# EAGLE design SuperJacobv5 (EAGLE 9.4.2)
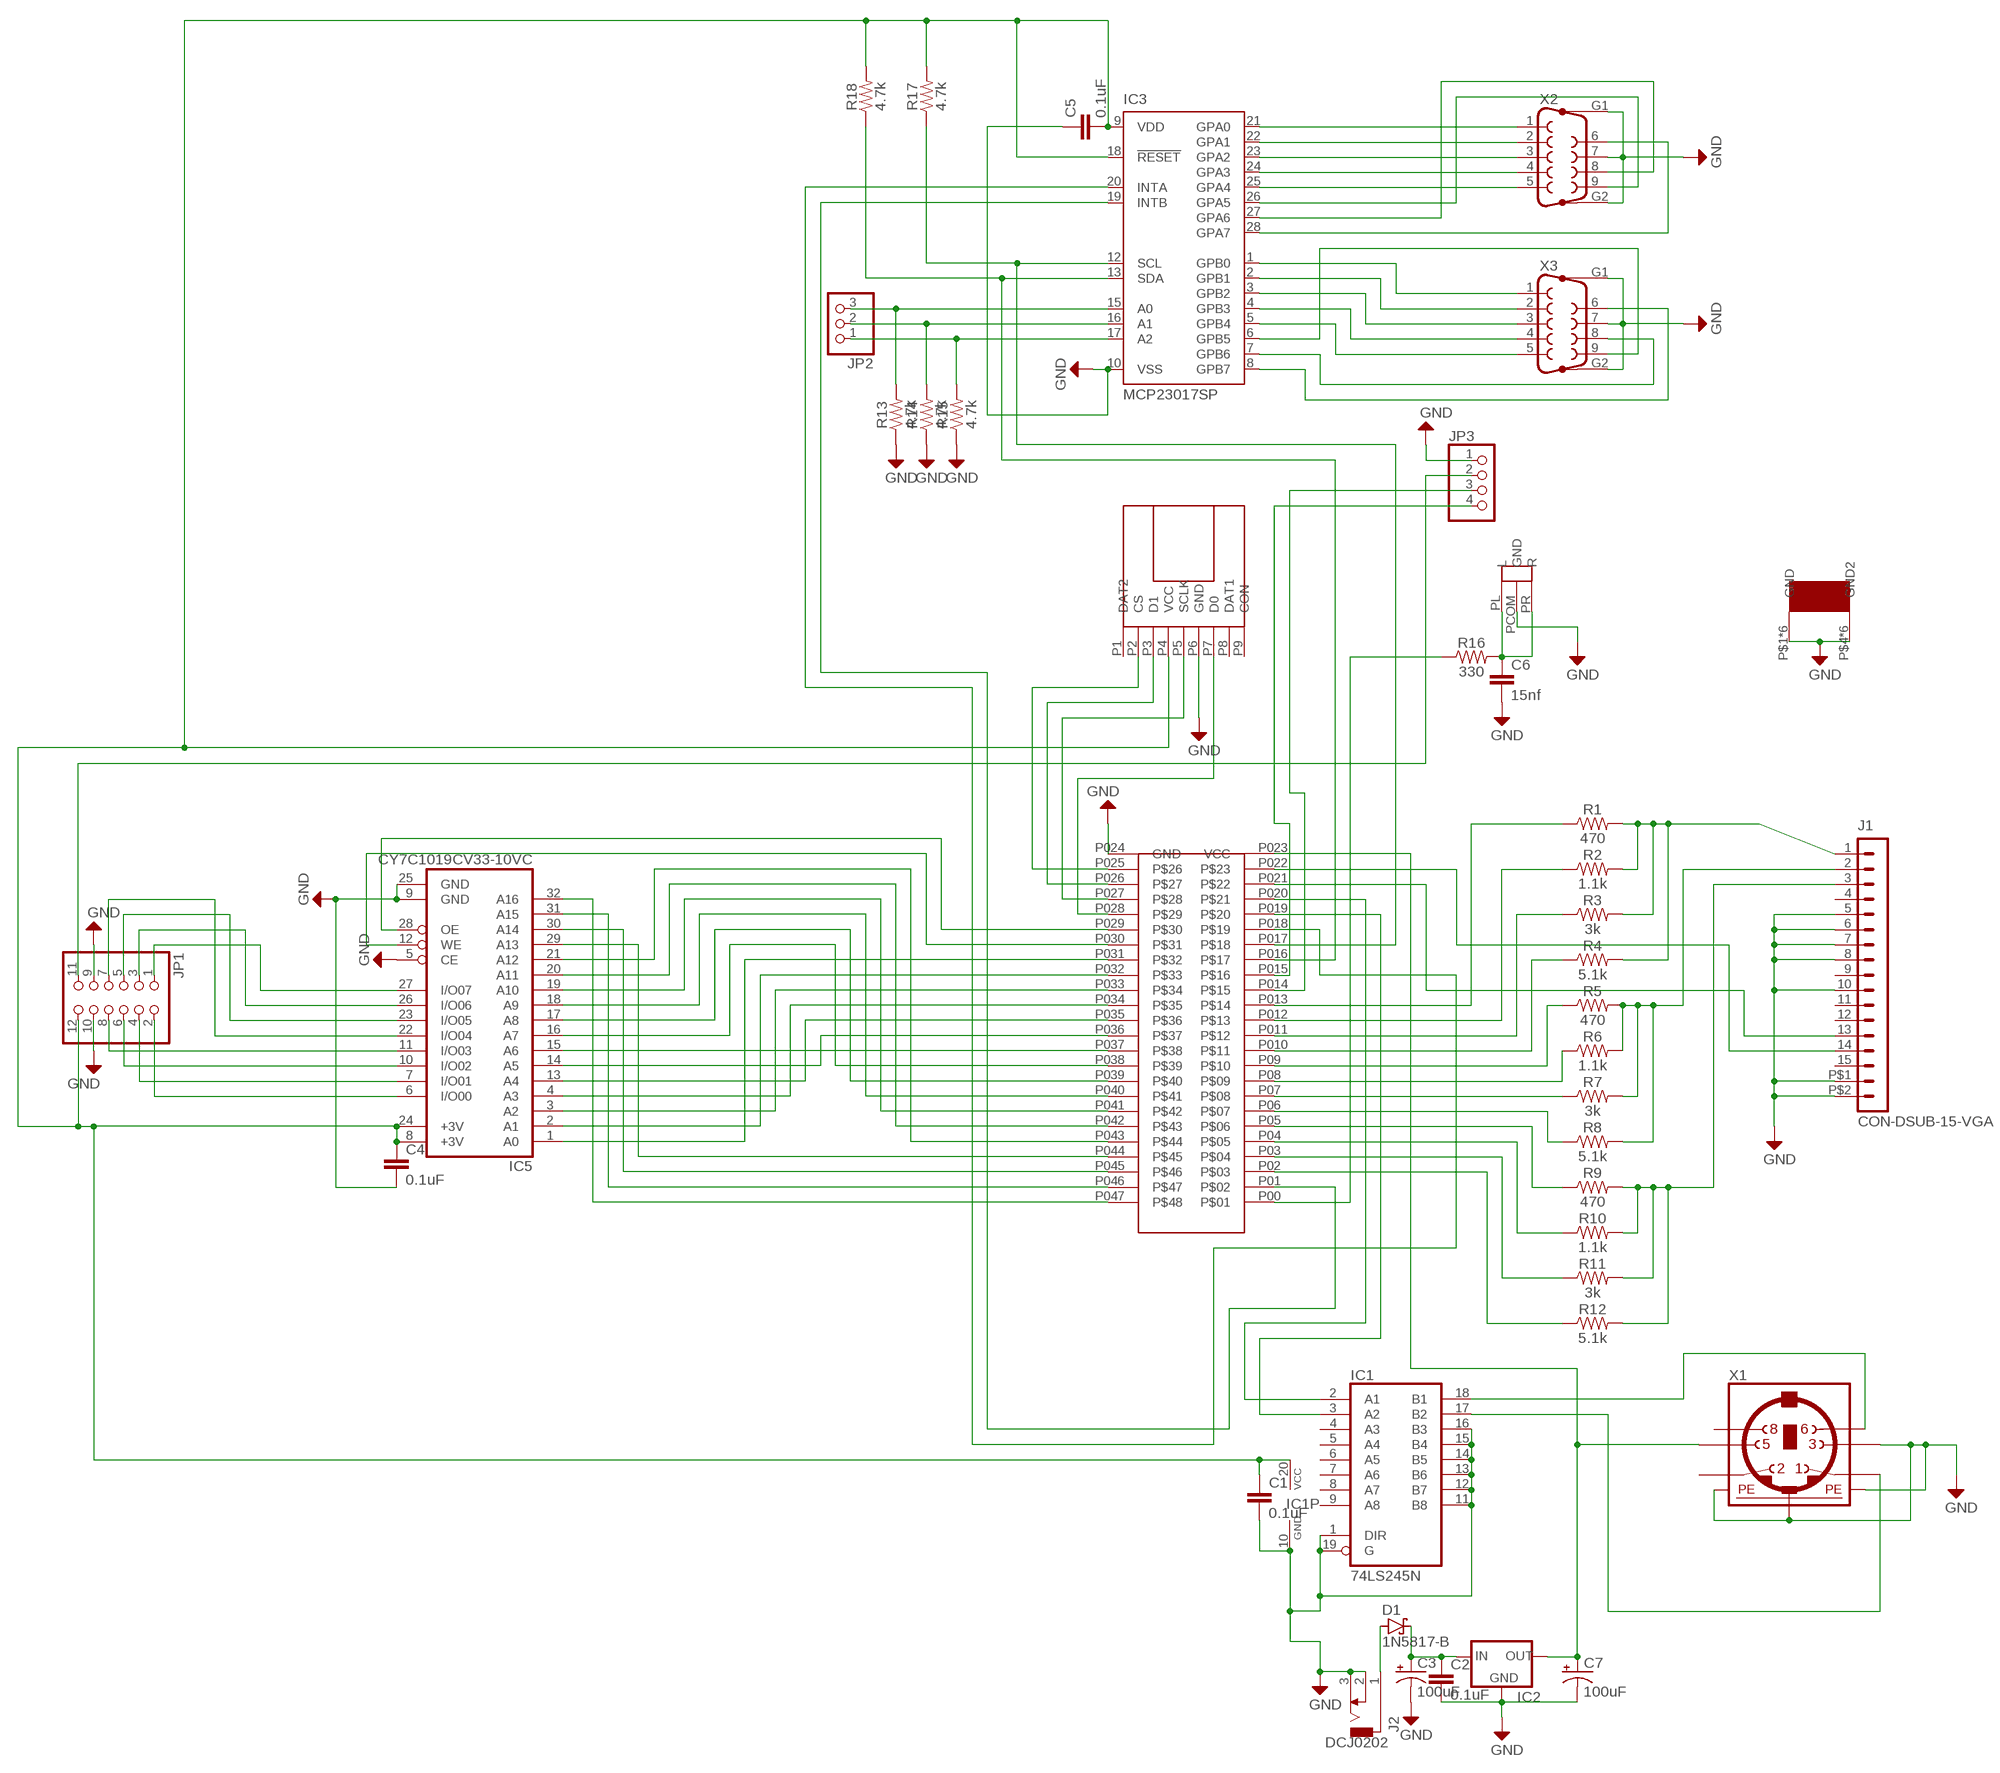
[diagram p0: schematic, sheet 1]

## Parts
C1  0.1uF  0.1UF-KIT-EZ-50V-20%  [CAP-PTH-SMALL-KIT]
C2  0.1uF  0.1UF-KIT-EZ-50V-20%  [CAP-PTH-SMALL-KIT]
C3  100uF  10UF-POLAR-RADIAL-2.5MM-25V-20%  [CPOL-RADIAL-2.5MM-5MM]
C4  0.1uF  0.1UF-KIT-EZ-50V-20%  [CAP-PTH-SMALL-KIT]
C5  0.1uF  0.1UF-KIT-EZ-50V-20%  [CAP-PTH-SMALL-KIT]
C6  15nf  0.1UF-KIT-EZ-50V-20%  [CAP-PTH-SMALL-KIT]
C7  100uF  10UF-POLAR-RADIAL-2.5MM-25V-20%  [CPOL-RADIAL-2.5MM-5MM]
D1  1N5817-B  [DO41-7.6]
IC1  74LS245N  [DIL20]
IC2  78XXL  [78XXL]
IC3  MCP23017SP  [DIL28-3]
IC5  CY7C1019CV33-10VC  [SOJ32-400]
J1  CON-DSUB-15-VGA  [181-015-212-171]
J2  DCJ0202  [DCJ0202]
JP1  PINHD-2X6  [2X06]
JP2  PINHD-1X3  [1X03]
JP3  PINHD-1X4  [1X04]
R1  470  1KOHM-HORIZ-1/4W-1%  [AXIAL-0.3]
R2  1.1k  1KOHM-HORIZ-1/4W-1%  [AXIAL-0.3]
R3  3k  1KOHM-HORIZ-1/4W-1%  [AXIAL-0.3]
R4  5.1k  1KOHM-HORIZ-1/4W-1%  [AXIAL-0.3]
R5  470  1KOHM-HORIZ-1/4W-1%  [AXIAL-0.3]
R6  1.1k  1KOHM-HORIZ-1/4W-1%  [AXIAL-0.3]
R7  3k  1KOHM-HORIZ-1/4W-1%  [AXIAL-0.3]
R8  5.1k  1KOHM-HORIZ-1/4W-1%  [AXIAL-0.3]
R9  470  1KOHM-HORIZ-1/4W-1%  [AXIAL-0.3]
R10  1.1k  1KOHM-HORIZ-1/4W-1%  [AXIAL-0.3]
R11  3k  1KOHM-HORIZ-1/4W-1%  [AXIAL-0.3]
R12  5.1k  1KOHM-HORIZ-1/4W-1%  [AXIAL-0.3]
R13  4.7k  1KOHM-HORIZ-1/4W-1%  [AXIAL-0.3]
R14  4.7k  1KOHM-HORIZ-1/4W-1%  [AXIAL-0.3]
R15  4.7k  1KOHM-HORIZ-1/4W-1%  [AXIAL-0.3]
R16  330  1KOHM-HORIZ-1/4W-1%  [AXIAL-0.3]
R17  4.7k  1KOHM-HORIZ-1/4W-1%  [AXIAL-0.3]
R18  4.7k  1KOHM-HORIZ-1/4W-1%  [AXIAL-0.3]
U$1  CMODA7  [CMODA7]
U$2  OPEN-SMARTTFCARDBREAKOUT  [OPEN-SMARTTFCARDBREAKOUT]
U$3  AUDIOJACK  [AUDIOJACK]
U$4  7085THERMALPAD  [7805THERMALPAD]
X1  MINI_DIN_6  [M_DIN6]
X2  F09HP  [F09HP]
X3  F09HP  [F09HP]

## Nets
+5V: C7.1(+) IC2.OUT U$1.P023(VCC) X1.5
ANLGPAD1: JP3.3 U$1.P014
ANLGPAD2: JP3.4 U$1.P015
AUDIOPOSTFILTER: C6.1 R16.P$2 U$3.PL(L) U$3.PR(R)
AUDIOPREFILTER: R16.P$1 U$1.P00
BLUE: J1.3 R9.P$2 R10.P$2 R11.P$2 R12.P$2
BLUEBIT0: R12.P$1 U$1.P02
BLUEBIT1: R11.P$1 U$1.P03
BLUEBIT2: R10.P$1 U$1.P04
BLUEBIT3: R9.P$1 U$1.P05
GND: C1.2 C2.2 C3.2(-) C4.2 C5.1 C6.2 C7.2(-) IC1.1(DIR) IC1.10(GND) IC1.11(B8) IC1.12(B7) IC1.13(B6) IC1.14(B5) IC1.15(B4) IC1.16(B3) IC1.19(G) IC2.GND IC3.10(VSS) IC5.5(CE) IC5.9(GND) IC5.25(GND) J1.5 J1.6 J1.7 J1.8 J1.10 J1.P$1 J1.P$2 J2.2 J2.3 JP1.9 JP1.10 JP3.1 R13.P$1 R14.P$1 R15.P$1 U$1.P024(GND) U$2.P6(GND) U$3.PCOM(GND) U$4.P$1(GND) U$4.P$4(GND2) U$4.P$6(GND) U$4.P$7(GND) U$4.P$8(GND) U$4.P$9(GND) U$4.P$10(GND) U$4.P$11(GND2) U$4.P$14(GND2) U$4.P$19(GND2) U$4.P$21(GND2) U$4.P$24(GND2) X1.3 X1.SH1(PE1) X1.SH2(PE2) X1.SH3(PE3) X2.7 X2.G1 X2.G2 X3.7 X3.G1 X3.G2
GPIOCLK: IC3.12(SCL) R17.P$1 U$1.P017
GPIODATA: IC3.13(SDA) R18.P$1 U$1.P016
GPIOINTA: IC3.20(INTA) U$1.P018
GPIOINTB: IC3.19(INTB) U$1.P01
GREEN: J1.2 R5.P$2 R6.P$2 R7.P$2 R8.P$2
GREENBIT0: R8.P$1 U$1.P06
GREENBIT1: R7.P$1 U$1.P07
GREENBIT2: R6.P$1 U$1.P08
GREENBIT3: R5.P$1 U$1.P09
HSYNC: J1.13 U$1.P021
IOADDR0: IC3.15(A0) JP2.3 R13.P$2
IOADDR1: IC3.16(A1) JP2.2 R14.P$2
IOADDR2: IC3.17(A2) JP2.1 R15.P$2
JOY1DOWN: IC3.24(GPA3) X2.4
JOY1FIRE: IC3.26(GPA5) X2.9
JOY1LEFT: IC3.23(GPA2) X2.3
JOY1RIGHT: IC3.22(GPA1) X2.2
JOY1SPARE1: IC3.21(GPA0) X2.1
JOY1SPARE2: IC3.27(GPA6) X2.8
JOY1SPARE3: IC3.28(GPA7) X2.6
JOY1UP: IC3.25(GPA4) X2.5
JOY2DOWN: IC3.4(GPB3) X3.4
JOY2FIRE: IC3.6(GPB5) X3.9
JOY2LEFT: IC3.3(GPB2) X3.3
JOY2RIGHT: IC3.2(GPB1) X3.2
JOY2SPARE1: IC3.1(GPB0) X3.1
JOY2SPARE2: IC3.7(GPB6) X3.8
JOY2SPARE3: IC3.8(GPB7) X3.6
JOY2UP: IC3.5(GPB4) X3.5
KBCLK: IC1.18(B1) X1.6
KBCLK33V: IC1.2(A1) U$1.P020
KBDATA: IC1.17(B2) X1.1
KBDATA33V: IC1.3(A2) U$1.P019
N$1: D1.A J2.1
POWERIN: C2.1 C3.1(+) D1.C IC2.IN
RAM10: IC5.19(A10) U$1.P041
RAM11: IC5.20(A11) U$1.P042
RAMA0: IC5.1(A0) U$1.P031
RAMA1: IC5.2(A1) U$1.P032
RAMA2: IC5.3(A2) U$1.P033
RAMA3: IC5.4(A3) U$1.P034
RAMA4: IC5.13(A4) U$1.P035
RAMA5: IC5.14(A5) U$1.P036
RAMA6: IC5.15(A6) U$1.P037
RAMA7: IC5.16(A7) U$1.P038
RAMA8: IC5.17(A8) U$1.P039
RAMA9: IC5.18(A9) U$1.P040
RAMA12: IC5.21(A12) U$1.P043
RAMA13: IC5.29(A13) U$1.P044
RAMA14: IC5.30(A14) U$1.P045
RAMA15: IC5.31(A15) U$1.P046
RAMA16: IC5.32(A16) U$1.P047
RAMIO0: IC5.6(I/O00) JP1.2
RAMIO1: IC5.7(I/O01) JP1.4
RAMIO2: IC5.10(I/O02) JP1.6
RAMIO3: IC5.11(I/O03) JP1.8
RAMIO4: IC5.22(I/O04) JP1.7
RAMIO5: IC5.23(I/O05) JP1.5
RAMIO6: IC5.26(I/O06) JP1.3
RAMIO7: IC5.27(I/O07) JP1.1
RAMOE: IC5.28(OE) U$1.P029
RAMWE: IC5.12(WE) U$1.P030
RED: J1.1 R1.P$2 R2.P$2 R3.P$2 R4.P$2
REDBIT0: R4.P$1 U$1.P010
REDBIT1: R3.P$1 U$1.P011
REDBIT2: R2.P$1 U$1.P012
REDBIT3: R1.P$1 U$1.P013
SDCLK: U$1.P027 U$2.P5(SCLK)
SDCS: U$1.P025 U$2.P2(CS)
SDD0: U$1.P028 U$2.P7(D0)
SDD1: U$1.P026 U$2.P3(D1)
VCC3.3V-EXT: JP1.11 JP3.2
VCC+3.3V: C1.1 C4.1 C5.2 IC1.20(VCC) IC3.9(VDD) IC3.18(!RESET) IC5.8(+3V) IC5.24(+3V) JP1.12 R17.P$2 R18.P$2 U$2.P4(VCC)
VSYNC: J1.14 U$1.P022
Unconnected: IC1.4(A3) IC1.5(A4) IC1.6(A5) IC1.7(A6) IC1.8(A7) IC1.9(A8) J1.4 J1.9 J1.11 J1.12 J1.15 U$2.P1(DAT2) U$2.P8(DAT1) U$2.P9(CON) X1.2 X1.8

## Library data of the parts
C1 C2 C4 C5 = SparkFun-Capacitors:0.1UF: 0.1µF ceramic capacitors A capacitor is a passive two-terminal electrical component used to store electrical energy temporarily in an electric field.; PROD_ID: CAP-08370
C3 C7 = SparkFun-Capacitors:10UF-POLAR: 10.0µF polarized capacitors A capacitor is a passive two-terminal electrical component used to store electrical energy temporarily in an electric field.; PROD_ID: CAP-08440; VALUE: 10uF
C6 = SparkFun-Capacitors:0.1UF: 0.1µF ceramic capacitors A capacitor is a passive two-terminal electrical component used to store electrical energy temporarily in an electric field.; PROD_ID: CAP-08370; VALUE: 0.1uF
D1 = diode:1N581*: 1.0A SCHOTTKY BARRIER RECTIFIER Source: http://www.diodes.com/datasheets/ds23001.pdf
IC1 = 74xx-eu:74*245: Octal BUS TRANSCEIVER, 3-state
IC2 = v-reg:78XXL: VOLTAGE REGULATOR
IC3 = microchip:MCP23017: http://ww1.microchip.com/downloads/en/DeviceDoc/21952a.pdf Source: http://ww1.microchip.com/downloads/en/DeviceDoc/21952a.pdf; MF: MICROCHIP; MPN: MCP23017-E/SP; OC_FARNELL: 1332088; OC_NEWARK: 31K2959
IC5 = CY7C109D:CY7C1019CV33: 128K x 8 Static RAM 10ns Source: Cypress CYP05780611.pdf
J1 = m-pad-2.1:CON-DSUB-15-VGA: NORCOMP's High Density 90° PC Mount D-Sub Connector 181 Series: SPECIFICATIONS: Contact Rating: 5 Amps Dielectric Strength: 1000V AC RMS Insulation Resistance: 1000 meg ohms Contact Material: Phosphor Bronze Contact Finish: Gold flash over Nickel Operating Temperature: -55°C to 150°C Shell Material: Steel, Tin Plated Insulations Material: Glass-Filled Polyester (UL94V-0) Gender: Receptacle (female) Please send any comments to: messi@users.sourceforge.net
J2 = con-jack:DCJ0202: DC POWER JACK Source: DCJ0202.pdf; OC_FARNELL: unknown; OC_NEWARK: unknown
JP1 = pinhead:PINHD-2X6: PIN HEADER
JP2 = pinhead:PINHD-1X3: PIN HEADER
JP3 = pinhead:PINHD-1X4: PIN HEADER
R1-R18 = SparkFun-Resistors:1KOHM: 1kΩ resistor A resistor is a passive two-terminal electrical component that implements electrical resistance as a circuit element. Resistors act to reduce current flow, and, at the same time, act to lower voltage levels within circuits. - Wikipedia; PROD_ID: RES-12182; VALUE: 1k
U$1 = my-library:CMODA7
U$2 = my-library:OPEN-SMARTTFCARDBREAKOUT
U$3 = my-library:AUDIOJACK
U$4 = my-library:7085THERMALPAD
X1 = mini_din:MINI_DIN_6
X2 X3 = con-subd:F09HP: SUB-D; OC_FARNELL: unknown; OC_NEWARK: unknown

## Board
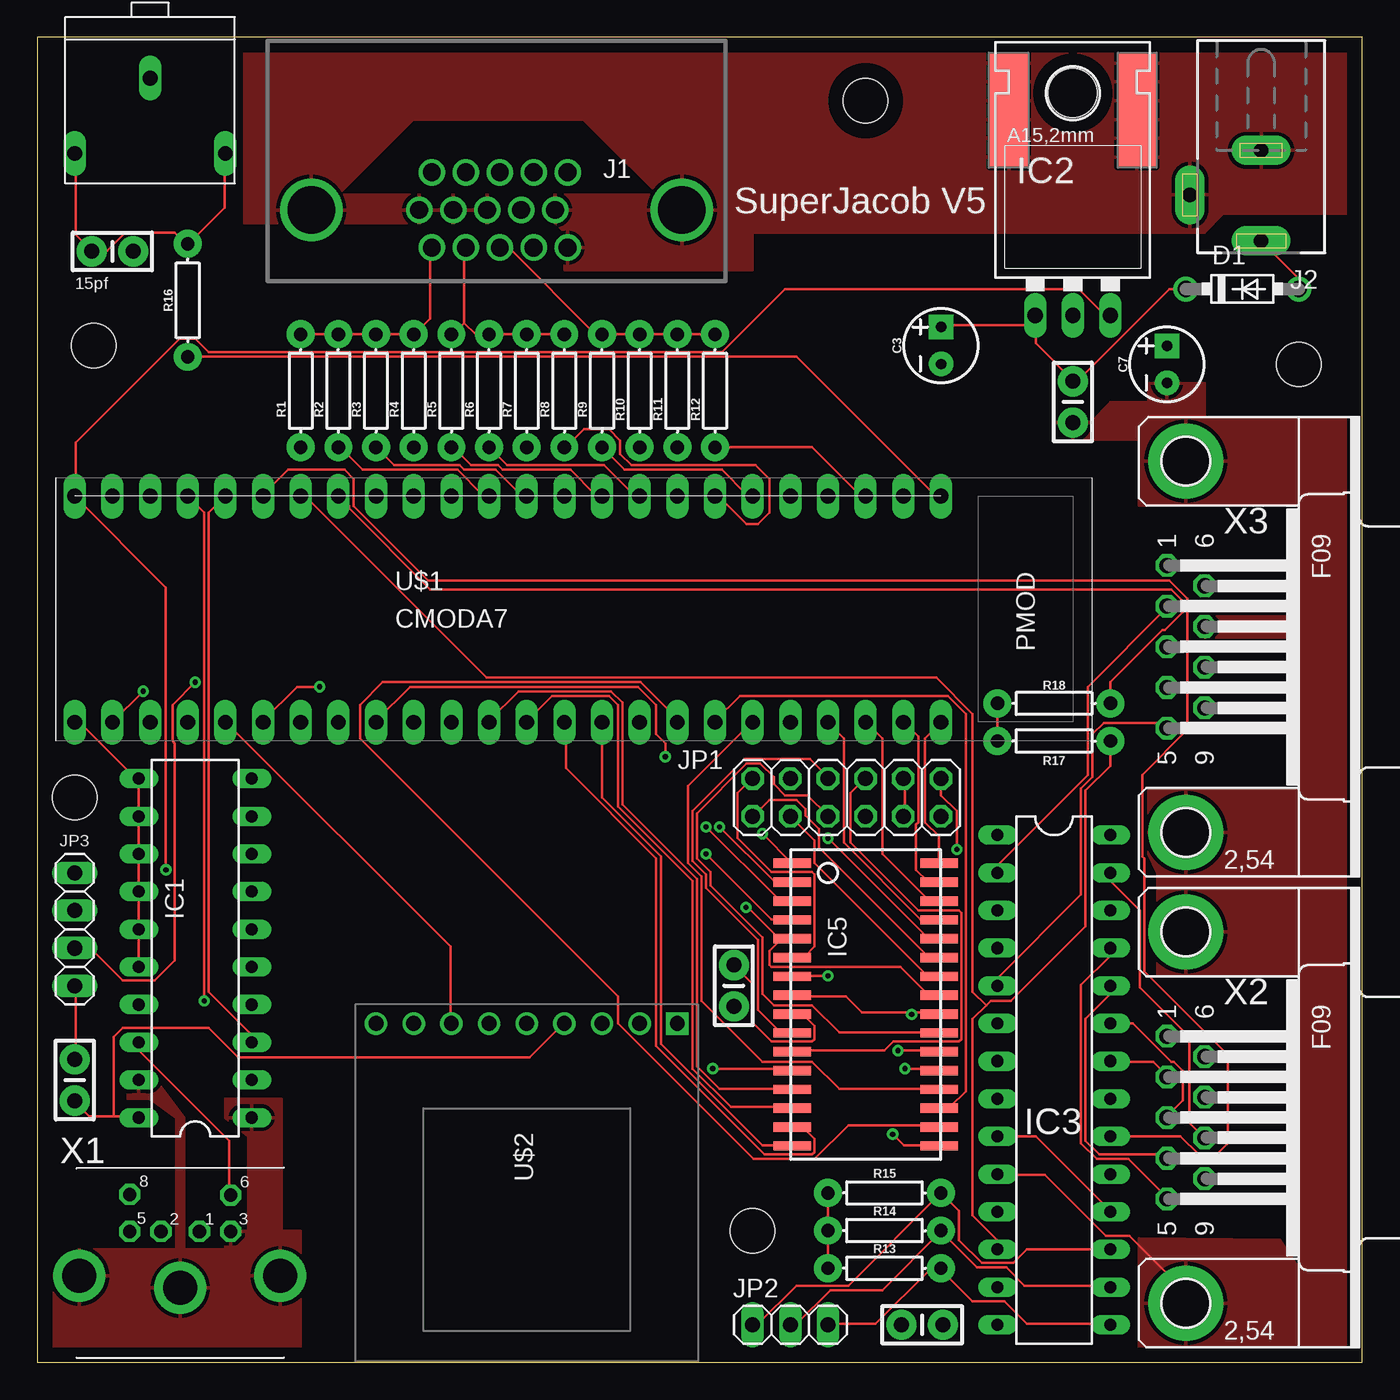
[diagram p1: board, top side]
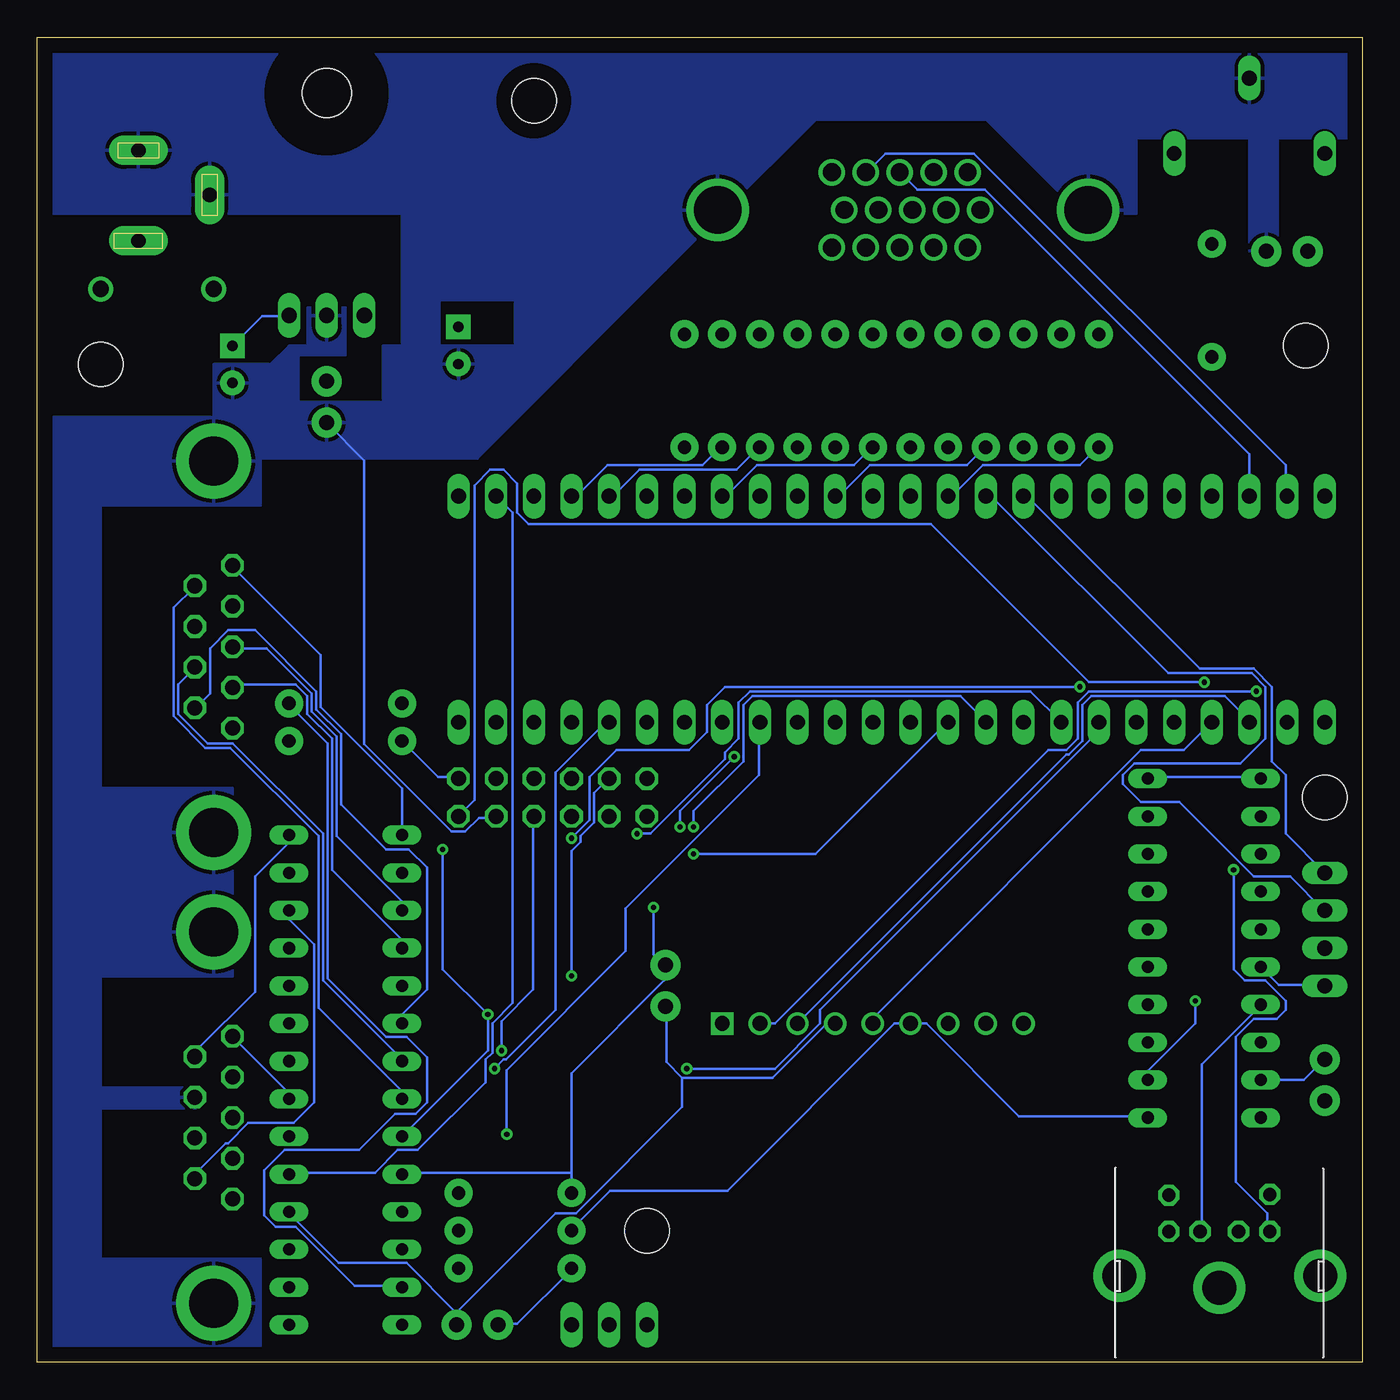
[diagram p2: board, bottom side, seen from below]

Size 89.38 x 89.38 mm. Coordinates in mm from the lower left corner, seen from the top.
Outline: 0,0 89.38,0 89.38,89.38 0,89.38 0,0
Copper layers (1*16): Top 0.035mm / dielectric 1.5mm / Bottom 0.035mm
Design rules "default": minimum track width 6mil, minimum drill 0.35mm, track to track 6mil, track to pad 6mil, pad to pad 6mil, via to via 6mil, smd to smd 6mil, copper to edge 40mil, drill to drill 6mil, minimum pad ring 10mil, minimum via ring 8mil, stop-mask expansion 4mil, vias tented up to drill 0mil, thermal gap 10mil
Holes 3 mm at 85.09,67.31 48.26,8.89 3.81,68.58 2.54,38.1 55.88,85.09

### Footprints (pad centres in the part's own frame; a part is rotated, then mirrored left to right if it is on the bottom)
CAP-PTH-SMALL-KIT = drill 1.016 pad 2.032: 1 -1.397,0; 2 1.397,0
CPOL-RADIAL-2.5MM-5MM = drill 0.7 pad 1.651 square: 1 1.25,0 | drill 0.7 pad 1.651: 2 -1.25,0
DO41-7.6 = drill 1.1 pad 1.7: A 3.81,0; C -3.81,0
DIL20 = drill 0.813 long: 1 -11.43,-3.81; 2 -8.89,-3.81; 3 -6.35,-3.81; 4 -3.81,-3.81; 5 -1.27,-3.81; 6 1.27,-3.81; 7 3.81,-3.81; 8 6.35,-3.81; 9 8.89,-3.81; 10 11.43,-3.81; 11 11.43,3.81; 12 8.89,3.81; 13 6.35,3.81; 14 3.81,3.81; 15 1.27,3.81; 16 -1.27,3.81; 17 -3.81,3.81; 18 -6.35,3.81; 19 -8.89,3.81; 20 -11.43,3.81
78XXL = drill 1.016 long: GND 0,-3.81; IN -2.54,-3.81; OUT 2.54,-3.81 | hole 3.302: 0,11.176
DIL28-3 = drill 0.813 long: 1 -16.51,-3.81; 2 -13.97,-3.81; 3 -11.43,-3.81; 4 -8.89,-3.81; 5 -6.35,-3.81; 6 -3.81,-3.81; 7 -1.27,-3.81; 8 1.27,-3.81; 9 3.81,-3.81; 10 6.35,-3.81; 11 8.89,-3.81; 12 11.43,-3.81; 13 13.97,-3.81; 14 16.51,-3.81; 15 16.51,3.81; 16 13.97,3.81; 17 11.43,3.81; 18 8.89,3.81; 19 6.35,3.81; 20 3.81,3.81; 21 1.27,3.81; 22 -1.27,3.81; 23 -3.81,3.81; 24 -6.35,3.81; 25 -8.89,3.81; 26 -11.43,3.81; 27 -13.97,3.81; 28 -16.51,3.81
SOJ32-400 = smd 0.635 x 2.54: 1 -9.525,-4.953; 2 -8.255,-4.953; 3 -6.985,-4.953; 4 -5.715,-4.953; 5 -4.445,-4.953; 6 -3.175,-4.953; 7 -1.905,-4.953; 8 -0.635,-4.953; 9 0.635,-4.953; 10 1.905,-4.953; 11 3.175,-4.953; 12 4.445,-4.953; 13 5.715,-4.953; 14 6.985,-4.953; 15 8.255,-4.953; 16 9.525,-4.953; 17 9.525,4.953; 18 8.255,4.953; 19 6.985,4.953; 20 5.715,4.953; 21 4.445,4.953; 22 3.175,4.953; 23 1.905,4.953; 24 0.635,4.953; 25 -0.635,4.953; 26 -1.905,4.953; 27 -3.175,4.953; 28 -4.445,4.953; 29 -5.715,4.953; 30 -6.985,4.953; 31 -8.255,4.953; 32 -9.525,4.953
181-015-212-171 = drill 1.194: 1 4.371,2.541; 2 2.08,2.541; 3 -0.211,2.541; 4 -2.502,2.541; 5 -4.793,2.541; 6 5.217,0; 7 2.926,0; 8 0.635,0; 9 -1.656,0; 10 -3.947,0; 11 4.371,-2.541; 12 2.08,-2.541; 13 -0.211,-2.541; 14 -2.502,-2.541; 15 -4.793,-2.541 | drill 3.2: P$1 -12.502,0; P$2 12.502,0
DCJ0202 = drill 1 pad 2 long: 1 0,3.1; 2 4.8,0; 3 0,-3
2X06 = drill 1.016 octagon: 1 -6.35,-1.27; 2 -6.35,1.27; 3 -3.81,-1.27; 4 -3.81,1.27; 5 -1.27,-1.27; 6 -1.27,1.27; 7 1.27,-1.27; 8 1.27,1.27; 9 3.81,-1.27; 10 3.81,1.27; 11 6.35,-1.27; 12 6.35,1.27
1X03 = drill 1.016 long: 1 -2.54,0; 2 0,0; 3 2.54,0
1X04 = drill 1.016 long: 1 -3.81,0; 2 -1.27,0; 3 1.27,0; 4 3.81,0
AXIAL-0.3 = drill 0.9 pad 1.88: P$1 -3.81,0; P$2 3.81,0
CMODA7 = drill 1 long: P00 -7.62,25.4; P01 -7.62,22.86; P02 -7.62,20.32; P03 -7.62,17.78; P04 -7.62,15.24; P05 -7.62,12.7; P06 -7.62,10.16; P07 -7.62,7.62; P08 -7.62,5.08; P09 -7.62,2.54; P010 -7.62,0; P011 -7.62,-2.54; P012 -7.62,-5.08; P013 -7.62,-7.62; P014 -7.62,-10.16; P015 -7.62,-12.7; P016 -7.62,-15.24; P017 -7.62,-17.78; P018 -7.62,-20.32; P019 -7.62,-22.86; P020 -7.62,-25.4; P021 -7.62,-27.94; P022 -7.62,-30.48; P023 -7.62,-33.02; P024 7.62,-33.02; P025 7.62,-30.48; P026 7.62,-27.94; P027 7.62,-25.4; P028 7.62,-22.86; P029 7.62,-20.32; P030 7.62,-17.78; P031 7.62,-15.24; P032 7.62,-12.7; P033 7.62,-10.16; P034 7.62,-7.62; P035 7.62,-5.08; P036 7.62,-2.54; P037 7.62,0; P038 7.62,2.54; P039 7.62,5.08; P040 7.62,7.62; P041 7.62,10.16; P042 7.62,12.7; P043 7.62,15.24; P044 7.62,17.78; P045 7.62,20.32; P046 7.62,22.86; P047 7.62,25.4
OPEN-SMARTTFCARDBREAKOUT = drill 1 square: P1 5.08,10.16 | drill 1: P2 5.08,7.62; P3 5.08,5.08; P4 5.08,2.54; P5 5.08,0; P6 5.08,-2.54; P7 5.08,-5.08; P8 5.08,-7.62; P9 5.08,-10.16
AUDIOJACK = drill 1 long: PCOM 0,-3.81; PL -5.08,1.27; PR 5.08,1.27
7805THERMALPAD = smd 2.54 x 1.27: P$1 -5.588,1.27; P$4 3.048,1.27; P$6 -5.588,0; P$7 -5.588,-1.27; P$8 -5.588,-2.54; P$9 -5.588,-3.81; P$10 -5.588,-5.08; P$11 3.048,-2.54; P$14 3.048,-1.27; P$19 3.048,0; P$21 3.048,-3.81; P$24 3.048,-5.08
M_DIN6 = drill 0.9 pad 1.422 octagon: 1 -1.3,-3.75; 2 1.3,-3.75; 3 -3.4,-3.75; 5 3.4,-3.75; 6 -3.4,-6.2; 8 3.4,-6.25 | drill 2.3 pad 3.5: SH1 6.8,-0.75; SH2 0,0.05; SH3 -6.75,-0.75
F09HP = drill 1.016 octagon: 1 -5.486,-1.27; 2 -2.743,-1.27; 3 0,-1.27; 4 2.743,-1.27; 5 5.486,-1.27; 6 -4.115,1.27; 7 -1.372,1.27; 8 1.372,1.27; 9 4.115,1.27 | drill 3.302 pad 5.08: G1 -12.522,0; G2 12.522,0

### Placement (x,y rotation side)
C1  2.54,19.05 90 top
C2  69.85,64.77 270 top
C3  60.96,68.58 90 top
C4  46.99,25.4 90 top
C5  59.69,2.54 0 top
C6  5.08,74.93 0 top
C7  76.2,67.31 90 top
D1  81.28,72.39 0 top
IC1  10.67,27.94 90 top
IC2  69.85,74.42 0 top
IC3  68.58,19.05 270 top
IC5  55.88,24.13 270 top
J1  30.99,77.72 180 top
J2  82.55,78.74 180 top
JP1  54.61,38.1 0 top
JP2  50.8,2.54 0 top
JP3  2.54,29.21 90 top
R1  17.78,65.53 90 top
R2  20.32,65.53 90 top
R3  22.86,65.53 90 top
R4  25.4,65.53 90 top
R5  27.94,65.53 90 top
R6  30.48,65.53 90 top
R7  33.02,65.53 90 top
R8  35.56,65.53 90 top
R9  38.1,65.53 90 top
R10  40.64,65.53 90 top
R11  43.18,65.53 90 top
R12  45.72,65.53 90 top
R13  57.15,6.35 0 top
R14  57.15,8.89 0 top
R15  57.15,11.43 0 top
R16  10.16,71.63 90 top
R17  68.58,41.91 180 top
R18  68.58,44.45 180 top
U$1  35.56,50.8 270 top
U$2  33.02,27.94 270 top
U$3  7.62,82.8 180 top
U$4  71.12,86.36 0 top
X1  9.65,5.08 180 top
X2  77.47,16.51 270 top
X3  77.47,48.26 270 top

### Tracks (layer width: path | path; a pad name or v marks a point on that pad's centre or on a via)
+5V  (via drill 0.35)
  Top 0.152: v8.69,33.22 8.69,52.27 U$1.P023 2.59,58.52 2.59,62.03 9.6,69.04 10.67,69.04 11.58,68.12 46.18,68.12 50.44,72.39 70.26,72.39 71.93,70.71 72.39,70.71 IC2.OUT
  Bottom 0.152: IC2.OUT 72.39,70.56 74.22,70.56 76.2,68.58 C7.1 | v8.69,33.22 8.69,26.52 7.92,25.76 6.55,25.76 5.18,24.38 5.18,23.77 5.79,23.16 7.32,23.16 8.53,21.95 8.53,12.19 6.4,10.06 6.4,8.84 X1.5
ANLGPAD1
  Bottom 0.152: U$1.P014 25.3,58.37 24.99,58.37 13.11,46.48 7.47,46.48 6.55,45.57 6.55,42.06 8.23,40.39 15.39,40.39 16.15,39.62 16.15,39.01 14.94,37.8 12.34,37.8 7.32,32.77 4.88,32.77 2.59,30.48 JP3.3
ANLGPAD2
  Bottom 0.152: JP3.4 5.18,35.66 5.18,39.62 6.1,40.54 6.1,45.57 7.32,46.79 10.97,46.79 22.55,58.37 22.86,58.37 U$1.P015
AUDIOPOSTFILTER
  Top 0.152: U$3.PR 2.59,81.53 2.59,76.05 3.66,74.98 C6.1 3.81,74.98 4.72,74.98 5.94,76.2 9.3,76.2 10.06,75.44 R16.P$2 10.21,75.44 12.65,77.88 12.65,81.53 U$3.PL
AUDIOPREFILTER
  Top 0.152: R16.P$1 51.21,67.82 60.5,58.52 60.96,58.52 U$1.P00
BLUE
  Top 0.152: R12.P$2 R11.P$2 R10.P$2 R9.P$2 37.64,69.34 31.85,75.13 31.24,75.13 J1.3
BLUEBIT0
  Top 0.152: R12.P$1 52.27,61.72 55.47,58.52 55.78,58.52 U$1.P02
BLUEBIT1
  Bottom 0.152: U$1.P03 53.34,58.52 52.88,58.52 50.9,60.5 44.5,60.5 43.28,61.72 R11.P$1
BLUEBIT2
  Bottom 0.152: U$1.P04 50.75,58.52 50.44,58.52 48.77,60.2 42.22,60.2 40.69,61.72 R10.P$1
BLUEBIT3
  Top 0.152: R9.P$1 39.62,60.2 46.18,60.2 47.85,58.52 48.16,58.52 U$1.P05
GND  (via drill 0.35)
  Top 0.152: JP3.1 2.59,25.3 2.59,20.57 C1.2 | IC1.16 IC1.15 IC1.14 IC1.13 IC1.12 6.86,39.17 | IC1.11 6.86,39.17 | 6.86,39.17 2.9,43.13 2.59,43.13 U$1.P024 | 50.14,28.5 50.9,28.5 IC5.5 50.14,28.5 | 50.14,28.5 49.38,27.74 49.38,26.82 49.53,26.67 58.22,26.67 60.05,24.84 60.81,24.84 IC5.25 | IC5.9 51.05,23.47 51.66,23.47 52.43,22.71 52.43,21.79 52.27,21.64 49.53,21.64 48.31,22.86 48.31,25.45 47.09,26.67 C4.2 | R13.P$1 R14.P$1 R15.P$1 | 50.14,28.5 47.95,30.68 v47.8,30.68 | JP1.9 58.52,36.88 58.52,39.32 JP1.10 | IC3.10 64.77,12.65 67.97,12.65 72.08,8.53 73.66,8.53 77.47,4.72 X2.G2
  Bottom 0.152: IC1.1 14.48,16.61 23.16,16.61 29.41,22.86 U$2.P6 31.55,22.86 42.82,11.58 50.75,11.58 53.34,8.99 R14.P$1 | IC1.19 3.96,19.05 2.59,20.42 C1.2 | IC1.10 14.48,39.47 6.86,39.47 IC1.11 | IC1.16 5.64,25.45 2.59,25.45 JP3.1 | C5.1 58.22,2.59 57,2.59 53.34,6.25 R13.P$1 | R15.P$1 53.34,12.8 | 53.34,12.8 53.34,19.51 47.09,25.76 47.09,26.67 C4.2 47.09,26.82 47.8,27.53 v47.8,30.68 | JP1.9 58.52,36.73 59.59,36.73 60.5,35.81 61.42,35.81 67.31,41.71 67.31,60.83 C2.2 | 53.34,12.8 64.77,12.8 IC3.10
  pour Top: 77.47,88.9 77.47,76.2 48.26,76.2 48.26,88.9
  pour Top: 0,0 0,7.62 12.7,7.62 12.7,8.89 17.78,8.89 17.78,0
  pour Bottom: 0,88.9 0,82.55 5.71,82.55 5.71,74.93 7.62,74.93 7.62,82.55 15.24,82.55 15.24,77.47 19.05,77.47 25.4,83.82 36.83,83.82 43.18,77.47 45.72,77.47 45.72,88.9
  pour Top: 48.26,88.9 13.97,88.9 13.97,77.47 17.78,77.47 19.05,77.47 25.4,83.82 36.83,83.82 43.18,77.47 48.26,77.47
  pour Top: 77.47,76.2 78.74,76.2 80.01,77.47 88.9,77.47 88.9,88.9 77.47,88.9
  pour Top: 30.48,78.74 30.48,76.83 13.97,76.83 13.97,78.74
  pour Top: 46.99,78.74 34.29,78.74 34.29,77.47 35.56,76.2 35.56,73.66 48.26,73.66 48.26,78.74
  pour Top: 88.9,63.75 78.74,63.75 78.74,66.04 74.93,66.04 74.93,64.77 72.39,64.77 71.12,63.5 68.58,63.5 68.58,62.23 74.3,62.23 74.3,57.78 85.09,57.78 85.09,50.29 78.74,50.29 78.74,48.9 85.09,48.9 85.09,38.73 74.93,38.73 74.93,34.29 75.56,33.02 75.56,26.04 85.09,26.04 85.09,15.88 84.58,15.88 84.58,14.61 85.09,14.61 85.09,6.35 83.82,8.26 74.3,8.38 74.3,1.02 88.9,1.02
  pour Bottom: 74.3,6.99 85.09,6.99 85.09,26.04 76.2,26.04 76.2,38.73 85.09,38.73 85.09,57.78 74.3,57.78 74.3,63.75 88.9,63.75 88.9,1.02 74.3,1.02
  pour Bottom: 60.96,68.58 66.04,68.58 66.04,64.77 74.93,64.77 74.93,60.96 60.96,60.96
  pour Bottom: 77.47,62.23 77.47,67.31 73.66,67.31 72.39,68.58 71.12,68.58 71.12,71.12 68.58,71.12 68.58,67.94 71.75,67.94 71.75,62.23
  pour Bottom: 45.72,88.9 76.2,88.9 88.9,88.9 88.9,77.47 64.77,77.47 64.77,67.31 62.23,67.31 62.23,73.66 46.99,73.66 41.91,78.74 41.91,80.01 41.91,88.9
  pour Bottom: 46.99,73.66 59.69,60.96 60.96,60.96 60.96,68.58 57.15,68.58 57.15,71.63 63.5,71.63 63.5,73.66
  pour Bottom: 85.09,18.54 78.11,18.54 78.11,17.14 85.09,17.14
  pour Top: 14.22,8.89 14.22,15.24 12.7,16.51 12.7,17.78 16.51,17.78 16.51,8.89
  pour Top: 9.4,7.62 9.4,16.51 7.62,17.78 6.1,17.78 6.1,19.56 7.62,19.56 9.91,16.51 9.91,7.62
GPIOCLK
  Top 0.152: IC3.12 64.77,8.23 63.09,9.91 63.09,23.16 64.01,24.08 | 64.01,24.08 64.31,24.38 65.68,24.38 70.71,29.41 70.71,38.56 72.39,40.23 R17.P$1 | 64.01,24.08 63.09,24.99 63.09,43.74 60.66,46.18 30.33,46.18 18.14,58.37 17.83,58.37 U$1.P017
GPIODATA
  Top 0.152: R18.P$1 72.39,45.87 75.89,49.38 76.05,49.38 77.27,50.6 77.27,51.36 76.5,52.12 26.52,52.12 21.03,57.61 21.03,57.76 20.42,58.37 U$1.P016
  Bottom 0.152: IC3.13 64.77,5.18 67.97,5.18 71.93,9.14 73.3,9.14 74.07,9.91 74.07,12.95 72.69,14.33 67.67,14.33 65.23,16.76 63.86,16.76 63.09,17.53 63.09,20.57 64.47,21.95 65.84,21.95 69.8,25.91 69.8,41.76 72.39,44.35 R18.P$1
GPIOINTA
  Top 0.152: IC3.20 77.11,15.24 78.33,14.02 79.55,14.02 80.31,14.78 80.31,20.73 74.68,26.36 74.68,33.98 74.52,34.14 74.52,39.62 77.57,42.67 77.57,51.51 76.35,52.73 26.36,52.73 21.34,57.76 21.34,59.59 20.73,60.2 16.92,60.2 15.24,58.52 U$1.P018
GPIOINTB
  Bottom 0.152: U$1.P01 57.3,57.3 57.3,24.23 58.67,22.86 58.67,20.88 59.13,20.42 59.13,18.9 63.7,14.33 65.08,14.33 66.6,12.8 72.39,12.8 IC3.19
GREEN
  Top 0.152: R8.P$2 R7.P$2 R6.P$2 29.57,69.34 28.8,70.1 | 28.8,70.1 28.8,75.13 J1.2 | 28.8,70.1 28.04,69.34 R5.P$2
GREENBIT0
  Top 0.152: U$1.P06 45.72,58.37 46.02,58.37 47.85,56.54 48.62,56.54 49.38,57.3 49.38,59.59 48.46,60.5 40.08,60.5 39.32,61.27 39.32,62.18 38.56,62.94 36.88,62.94 35.66,61.72 R8.P$1
GREENBIT1
  Bottom 0.152: U$1.P07 43.13,58.52 42.82,58.52 40.84,60.5 34.29,60.5 33.07,61.72 R7.P$1
GREENBIT2
  Top 0.152: R6.P$1 31.7,60.5 38.25,60.5 40.23,58.52 40.54,58.52 U$1.P08
GREENBIT3
  Top 0.152: U$1.P09 38.1,58.52 37.64,58.52 35.97,60.2 31.39,60.2 31.09,60.5 29.26,60.5 28.04,61.72 R5.P$1
HSYNC
  Bottom 0.152: U$1.P021 7.62,61.27 25.45,79.1 30.02,79.1 31.09,80.16 J1.13
IOADDR0
  Top 0.152: 60.96,6.25 63.09,4.12 65.23,4.12 66.75,2.59 72.39,2.59 IC3.15 | 60.96,6.25 60.2,6.25 56.54,2.59 53.34,2.59 JP2.3 | 60.96,6.25 R13.P$2
IOADDR1
  Top 0.152: 60.96,8.84 63.4,6.4 65.38,6.4 66.6,5.18 72.39,5.18 IC3.16 | 60.96,8.84 57,4.88 53.49,4.88 51.21,2.59 50.9,2.59 JP2.2 | 60.96,8.84 R14.P$2
IOADDR2
  Top 0.152: IC3.17 66.75,7.62 65.84,6.71 63.7,6.71 62.18,8.23 62.18,10.21 R15.P$2 54.71,5.18 51.21,5.18 48.62,2.59 48.31,2.59 JP2.1
JOY1DOWN
  Top 0.152: IC3.24 72.39,24.84 70.71,23.16 70.71,14.94 71.63,14.02 76.05,14.02 76.2,13.87 X2.4
JOY1FIRE
  Bottom 0.152: IC3.26 72.39,29.87 70.71,28.19 70.71,17.53 72.08,16.15 75.13,16.15 76.5,14.78 76.66,14.78 78.64,12.8 78.64,12.5 X2.9
JOY1LEFT
  Top 0.152: IC3.23 73.91,22.86 76.5,20.27 76.66,20.27 77.27,19.66 77.27,17.68 76.2,16.61 X2.3
JOY1RIGHT
  Top 0.152: IC3.22 72.39,20.27 75.29,20.27 76.2,19.36 X2.2
JOY1SPARE1
  Bottom 0.152: IC3.21 72.39,18.14 76.2,21.95 X2.1
JOY1SPARE2
  Top 0.152: IC3.27 72.39,32.46 74.37,30.48 74.37,25.3 77.72,21.95 77.72,16.15 X2.8
JOY1SPARE3
  Bottom 0.152: IC3.28 72.39,35.05 74.68,32.77 74.68,24.99 78.64,21.03 78.64,20.73 X2.6
JOY1UP
  Top 0.152: IC3.25 72.39,27.43 70.41,25.45 70.41,14.78 71.48,13.72 73.61,13.72 76.2,11.12 X2.5
JOY2DOWN
  Bottom 0.152: IC3.4 64.77,28.5 69.49,33.22 69.49,42.06 71.17,43.74 71.17,44.96 71.93,45.72 76.05,45.72 76.2,45.57 X3.4
JOY2FIRE
  Bottom 0.152: IC3.6 64.77,23.47 63.09,25.15 63.09,33.38 64.31,34.59 65.84,34.59 68.89,37.64 68.89,42.37 70.56,44.04 70.56,45.26 74.68,49.38 76.5,49.38 77.72,48.16 77.72,45.11 78.64,44.2 X3.9
JOY2LEFT
  Bottom 0.152: IC3.3 64.77,31.09 69.19,35.51 69.19,42.22 70.87,43.89 70.87,45.11 73.91,48.16 76.2,48.16 X3.3
JOY2RIGHT
  Top 0.152: IC3.2 64.77,33.53 70.87,39.62 70.87,45.57 76.2,50.9 X3.2
JOY2SPARE1
  Bottom 0.152: IC3.1 64.77,38.71 70.26,44.2 70.26,47.7 76.2,53.65 X3.1
JOY2SPARE2
  Bottom 0.152: IC3.7 64.77,20.42 70.1,25.76 70.1,35.66 76.2,41.76 77.88,41.76 79.86,43.74 79.86,45.72 78.79,46.79 X3.8
JOY2SPARE3
  Bottom 0.152: IC3.8 64.77,18.29 70.41,23.93 70.41,35.51 76.35,41.45 78.03,41.45 80.16,43.59 80.16,50.9 78.79,52.27 X3.6
JOY2UP
  Top 0.152: IC3.5 64.77,25.91 70.41,31.55 70.41,38.71 71.17,39.47 71.17,42.37 71.93,43.13 75.89,43.13 76.2,42.82 X3.5
KBCLK
  Top 0.152: IC1.18 6.86,21.03 12.95,14.94 12.95,11.43 X1.6
KBCLK33V  (via drill 0.35)
  Top 0.152: v11.28,24.38 11.28,57.3 U$1.P020
  Bottom 0.152: IC1.2 14.48,19.66 11.28,22.86 v11.28,24.38
KBDATA
  Bottom 0.152: IC1.17 6.86,24.08 10.82,20.12 10.82,8.84 X1.1
KBDATA33V
  Top 0.152: IC1.3 14.48,22.1 11.58,24.99 11.58,57.3 U$1.P019
N$1
  Top 0.152: D1.A 85.04,72.39 85.04,73.15 82.6,75.59 J2.1
POWERIN
  Top 0.152: 67.36,69.95 67.36,68.73 69.8,66.29 C2.1 69.95,66.29 70.26,66.29 76.35,72.39 D1.C | 67.36,69.95 67.36,70.56 IC2.IN 67.36,69.95 | 67.36,69.95 60.96,69.95 C3.1
RAM10
  Top 0.152: IC5.19 60.96,17.22 61.57,17.22 62.64,18.29 62.64,43.74 61.42,44.96 47.4,44.96 45.72,43.28 U$1.P041
RAM11
  Top 0.152: IC5.20 60.81,18.44 54.1,18.44 52.27,20.27 48.92,20.27 44.81,24.38 44.81,32.77 43.89,33.68 43.89,38.86 48.16,43.13 U$1.P042
RAMA0  (via drill 0.35)
  Top 0.152: v48.92,35.66 IC5.1
  Bottom 0.152: v48.92,35.66 48.01,35.66 42.98,40.69 42.98,41.15 42.06,42.06 42.06,44.5 41.3,45.26 22.4,45.26 U$1.P031
RAMA1  (via drill 0.35)
  Top 0.152: v46.02,36.12 49.68,32.46 50.9,32.46 IC5.2 | v42.37,40.84 42.37,41.76 41.76,42.37 41.76,44.35 40.54,45.57 25.15,45.57 22.86,43.28 U$1.P032
  Bottom 0.152: v46.02,36.12 46.02,37.19 v42.37,40.84
RAMA2  (via drill 0.35)
  Top 0.152: v45.11,36.12 49.99,31.24 50.9,31.24 IC5.3
  Bottom 0.152: v45.11,36.12 45.11,37.19 41.76,40.54 41.76,44.35 41.15,44.96 27.13,44.96 25.45,43.28 U$1.P033
RAMA3  (via drill 0.35)
  Top 0.152: v45.11,34.29 49.53,29.87 50.9,29.87 IC5.4
  Bottom 0.152: v45.11,34.29 36.88,34.29 28.04,43.13 U$1.P034
RAMA4
  Top 0.152: IC5.13 50.9,18.44 46.02,18.44 44.5,19.96 44.5,32.61 39.47,37.64 39.47,44.5 38.71,45.26 32.46,45.26 30.48,43.28 U$1.P035
RAMA5
  Top 0.152: IC5.14 50.9,17.22 46.79,17.22 44.2,19.81 44.2,32.46 39.17,37.49 39.17,44.35 38.56,44.96 34.75,44.96 33.07,43.28 U$1.P036
RAMA6
  Top 0.152: IC5.15 51.05,15.85 51.66,15.85 52.43,15.09 52.43,14.17 52.27,14.02 49.07,14.02 41.76,21.34 41.76,33.98 35.66,40.08 35.66,43.13 U$1.P037
RAMA7
  Top 0.152: U$1.P038 38.1,38.1 42.06,34.14 42.06,21.49 48.92,14.63 50.9,14.63 IC5.16
RAMA8  (via drill 0.35)
  Top 0.152: v57.71,15.39 58.47,14.63 60.81,14.63 IC5.17
  Bottom 0.152: v57.71,15.39 57.71,19.71 49.68,27.74 49.68,30.63 40.69,39.62 40.69,43.13 U$1.P039
RAMA9
  Top 0.152: IC5.18 60.81,16 54.71,16 52.43,13.72 48.31,13.72 39.17,22.86 39.17,24.69 21.79,42.06 21.79,44.35 23.32,45.87 40.69,45.87 43.28,43.28 U$1.P040
RAMA12  (via drill 0.35)
  Top 0.152: v58.52,19.81 60.81,19.81 IC5.21
  Bottom 0.152: v58.52,19.81 57.91,20.42 57.76,20.42 54.41,23.77 54.41,39.78 50.9,43.28 U$1.P043
RAMA13
  Top 0.152: IC5.29 60.81,29.87 59.59,29.87 54.41,35.05 54.41,42.06 53.34,43.13 U$1.P044
RAMA14
  Top 0.152: U$1.P045 57,42.06 57,34.29 60.05,31.24 60.81,31.24 IC5.30
RAMA15
  Top 0.152: IC5.31 60.81,32.46 60.05,32.46 59.28,33.22 59.28,36.27 59.44,36.42 59.44,42.22 58.52,43.13 U$1.P046
RAMA16
  Top 0.152: IC5.32 60.81,33.68 60.81,35.51 59.89,36.42 59.89,42.06 60.96,43.13 U$1.P047
RAMIO0
  Top 0.152: IC5.6 51.05,27.43 51.82,27.43 52.43,28.04 52.43,32.92 52.27,33.07 49.53,33.07 47.24,35.36 47.24,38.41 48.16,39.32 JP1.2
RAMIO1  (via drill 0.35)
  Top 0.152: v53.34,26.06 51.05,26.06 IC5.7
  Bottom 0.152: JP1.4 50.9,39.32 51.82,38.41 51.82,36.42 52.73,35.51 52.73,35.1 53.34,34.5 v53.34,26.06
RAMIO2
  Top 0.152: IC5.10 50.9,22.25 50.14,22.25 48.62,23.77 48.62,28.5 45.11,32 45.11,32.92 44.2,33.83 44.2,37.19 47.7,40.69 52.12,40.69 53.34,39.47 JP1.6
RAMIO3
  Top 0.152: IC5.11 51.05,21.03 57.15,21.03 57.76,21.64 62.18,21.64 62.33,21.79 62.33,30.33 62.18,30.48 59.44,30.48 54.86,35.05 54.86,38.41 55.78,39.32 JP1.8
RAMIO4  (via drill 0.35)
  Top 0.152: v58.06,21.03 60.81,21.03 IC5.22
  Bottom 0.152: v58.06,21.03 58.06,23.01 55.93,25.15 55.93,36.73 JP1.7
RAMIO5
  Top 0.152: IC5.23 60.81,22.25 54.1,22.25 52.27,24.08 49.68,24.08 48.92,24.84 48.92,28.65 45.41,32.16 45.41,33.07 44.5,33.98 44.5,37.03 47.85,40.39 48.77,40.39 49.68,39.47 49.68,39.01 50.44,38.25 51.97,38.25 53.34,36.88 JP1.5
RAMIO6
  Top 0.152: JP1.3 52.43,35.2 52.43,33.68 60.05,26.06 60.81,26.06 IC5.26
RAMIO7
  Top 0.152: JP1.1 49.38,37.95 51.21,37.95 51.82,37.34 51.82,36.88 52.73,35.97 52.73,34.75 60.05,27.43 60.81,27.43 IC5.27
RAMOE  (via drill 0.35)
  Top 0.152: v53.34,35.36 60.05,28.65 60.81,28.65 IC5.28 | v19.05,45.57 17.53,45.57 15.24,43.28 U$1.P029
  Bottom 0.152: v53.34,35.36 52.12,36.58 52.12,39.47 50.29,41.3 45.41,41.3 44.2,42.52 44.2,44.35 42.98,45.57 v19.05,45.57
RAMWE  (via drill 0.35)
  Top 0.152: v45.57,19.81 50.9,19.81 IC5.12
  Bottom 0.152: v45.57,19.81 39.62,19.81 36.58,22.86 36.58,23.77 17.83,42.52 17.83,43.13 U$1.P030
RED
  Top 0.152: R1.P$2 R2.P$2 R3.P$2 R4.P$2 25.45,69.34 26.52,70.41 26.52,75.13 J1.1
REDBIT0
  Bottom 0.152: U$1.P010 35.51,58.52 35.2,58.52 33.22,60.5 26.67,60.5 25.45,61.72 R4.P$1
REDBIT1
  Top 0.152: R3.P$1 24.08,60.5 28.5,60.5 28.8,60.2 30.94,60.2 32.61,58.52 32.92,58.52 U$1.P011
REDBIT2
  Top 0.152: U$1.P012 30.48,58.52 30.02,58.52 28.35,60.2 21.95,60.2 20.42,61.72 R2.P$1
REDBIT3
  Bottom 0.152: U$1.P013 27.89,58.52 27.58,58.52 25.6,60.5 19.05,60.5 17.83,61.72 R1.P$1
SDCLK
  Bottom 0.152: U$1.P027 12.04,41.3 14.94,41.3 32.92,23.32 32.92,22.86 U$2.P5
SDCS  (via drill 0.35)
  Top 0.152: U$1.P025 v7.16,45.26
  Bottom 0.152: U$2.P2 39.62,22.86 21.18,41.3 19.96,41.3 19.2,42.06 19.2,44.5 18.44,45.26 v7.16,45.26
SDD0
  Top 0.152: U$1.P028 12.8,43.13 27.89,28.04 27.89,22.86 U$2.P7
SDD1
  Bottom 0.152: U$2.P3 19.96,41 19.81,41 18.9,41.91 18.9,44.35 18.29,44.96 9.3,44.96 7.62,43.28 U$1.P026
VCC3.3V-EXT  (via drill 0.35)
  Top 0.152: v10.67,45.87 9.14,44.35 9.14,41.91 9.3,41.76 9.3,27.13 7.92,25.76 5.79,25.76 3.66,27.89 2.59,27.89 JP3.2
  Bottom 0.152: v10.67,45.87 18.44,45.87 29.11,56.54 56.24,56.54 57,57.3 57,59.28 57.91,60.2 58.83,60.2 59.89,59.13 59.89,37.95 60.96,36.88 JP1.11
VCC+3.3V  (via drill 0.35)
  Top 0.152: 5.18,16.61 3.5,16.61 2.59,17.53 C1.1 | 5.18,16.61 6.86,16.61 IC1.20 | 5.18,16.61 5.18,21.95 5.79,22.55 11.58,22.55 13.56,20.57 33.22,20.57 35.51,22.86 U$2.P4 | R17.P$2 R18.P$2 | 58.98,23.62 60.81,23.62 IC5.24 | 58.98,23.62 55.63,23.62 54.56,24.69 51.05,24.69 IC5.8 | IC3.9 67.36,15.24 72.39,10.21 IC3.18 | v58.98,23.47 58.98,23.62 | JP1.12 60.96,38.25 62.03,37.19 v62.03,34.59
  Bottom 0.152: U$2.P4 36.12,22.86 39.78,19.2 45.87,19.2 | 45.87,19.2 46.94,20.27 46.94,23.93 C4.1 | R17.P$2 62.33,39.47 60.96,39.47 JP1.12 | 61.11,3.35 61.11,2.59 C5.2 61.11,3.35 | 61.11,3.35 64.47,6.71 69.04,6.71 72.39,10.06 IC3.18 | IC3.9 58.98,21.03 v58.98,23.47 62.03,26.52 v62.03,34.59 | 45.87,19.2 45.87,17.22 53.03,10.06 54.41,10.06 61.11,3.35
VSYNC
  Bottom 0.152: U$1.P022 5.18,58.52 5.18,60.5 26.21,81.53 32.16,81.53 33.38,80.31 J1.14

### Text on the board
tNames: SuperJacob V5 | 15pf